# Altium schematic sheet FrequencyDivider.SchDoc
size A
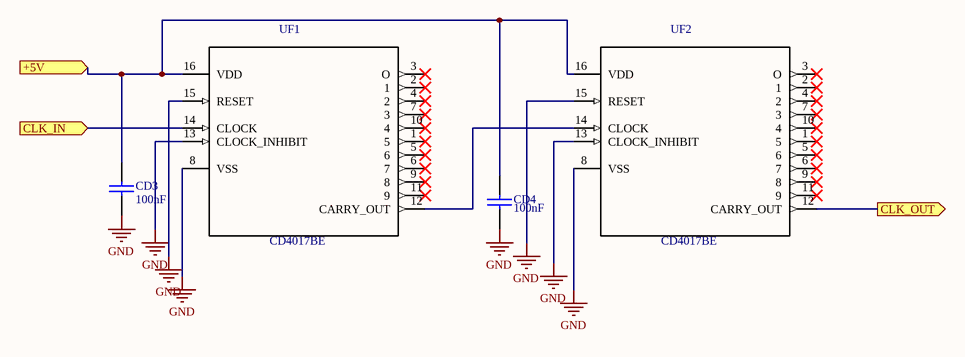
[diagram p0: FrequencyDivider.SchDoc]

## Parts
CD3  100nF  [0805]
CD4  100nF  [0805]
UF1  CD4017BE  [*DIP254P762X508-16]
UF2  CD4017BE  [*DIP254P762X508-16]

## Ports
+5V (in), CLK_IN (in), CLK_OUT (out)

## Nets
GND: CD3.1 CD4.1 UF1.8(VSS) UF1.13(CLOCK_INHIBIT) UF1.15(RESET) UF2.8(VSS) UF2.13(CLOCK_INHIBIT) UF2.15(RESET)
+5V: CD3.2 CD4.2 UF1.16(VDD) UF2.16(VDD) ; port +5V
CLK_IN: UF1.14(CLOCK) ; port CLK_IN
CLK_OUT: UF2.12(CARRY_OUT) ; port CLK_OUT
NetUF1_12: UF1.12(CARRY_OUT) UF2.14(CLOCK)

Not connected (* = marked no-connect by the designer): UF1 1(5)* 2(1)* 3(O)* 4(2)* 5(6)* 6(7)* 7(3)* 9(8)* 10(4)* 11(9)*; UF2 1(5)* 2(1)* 3(O)* 4(2)* 5(6)* 6(7)* 7(3)* 9(8)* 10(4)* 11(9)*

## Library data of the parts
CD3 CD4 = CAP
UF1 UF2 = CD4017BE: IC Mos 4017/CD4017BE HARRIS; MF: Texas; Price: None; Package: DIP-16 Intersil; SnapEDA_Link: https://www.snapeda.com/parts/CD4017BE/Texas%20Instruments/view-part/?ref=snap; Availability: Unavailable; MP: CD4017BE; Value: *